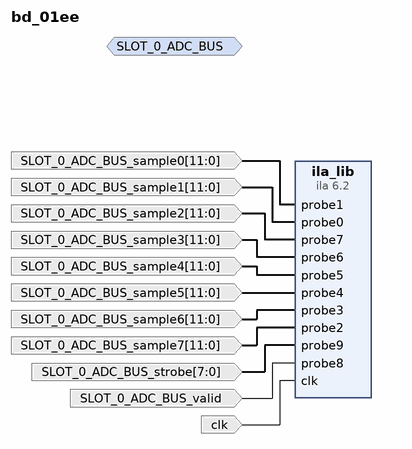
[diagram p0: block diagram of the top level]
# Vivado block design bd_01ee, xcku060-ffva1517-2-e, Vivado 2025.1
create_bd_design bd_01ee

create_bd_intf_port -mode Monitor -vlnv ti.com:user:adc_bus_rtl:1.0 SLOT_0_ADC_BUS
create_bd_port -dir I -type clk clk
create_bd_port -dir I -from 11 -to 0 SLOT_0_ADC_BUS_sample1
create_bd_port -dir I -from 11 -to 0 SLOT_0_ADC_BUS_sample0
create_bd_port -dir I -from 11 -to 0 SLOT_0_ADC_BUS_sample7
create_bd_port -dir I -from 11 -to 0 SLOT_0_ADC_BUS_sample6
create_bd_port -dir I -from 11 -to 0 SLOT_0_ADC_BUS_sample5
create_bd_port -dir I -from 11 -to 0 SLOT_0_ADC_BUS_sample4
create_bd_port -dir I -from 11 -to 0 SLOT_0_ADC_BUS_sample3
create_bd_port -dir I -from 11 -to 0 SLOT_0_ADC_BUS_sample2
create_bd_port -dir I SLOT_0_ADC_BUS_valid
create_bd_port -dir I -from 7 -to 0 SLOT_0_ADC_BUS_strobe

create_bd_cell -type ip -vlnv xilinx.com:ip:ila:6.2 ila_lib
set_property -dict [list \
  CONFIG.ALL_PROBE_SAME_MU TRUE \
  CONFIG.ALL_PROBE_SAME_MU_CNT 1 \
  CONFIG.C_ADV_TRIGGER FALSE \
  CONFIG.C_DATA_DEPTH 1024 \
  CONFIG.C_EN_STRG_QUAL 0 \
  CONFIG.C_ILA_CLK_FREQ 100000000 \
  CONFIG.C_INPUT_PIPE_STAGES 0 \
  CONFIG.C_MONITOR_TYPE Native \
  CONFIG.C_NUM_OF_PROBES 10 \
  CONFIG.C_PROBE0_TYPE 0 \
  CONFIG.C_PROBE0_WIDTH 12 \
  CONFIG.C_PROBE1_TYPE 0 \
  CONFIG.C_PROBE1_WIDTH 12 \
  CONFIG.C_PROBE2_TYPE 0 \
  CONFIG.C_PROBE2_WIDTH 12 \
  CONFIG.C_PROBE3_TYPE 0 \
  CONFIG.C_PROBE3_WIDTH 12 \
  CONFIG.C_PROBE4_TYPE 0 \
  CONFIG.C_PROBE4_WIDTH 12 \
  CONFIG.C_PROBE5_TYPE 0 \
  CONFIG.C_PROBE5_WIDTH 12 \
  CONFIG.C_PROBE6_TYPE 0 \
  CONFIG.C_PROBE6_WIDTH 12 \
  CONFIG.C_PROBE7_TYPE 0 \
  CONFIG.C_PROBE7_WIDTH 12 \
  CONFIG.C_PROBE8_TYPE 0 \
  CONFIG.C_PROBE8_WIDTH 1 \
  CONFIG.C_PROBE9_TYPE 0 \
  CONFIG.C_PROBE9_WIDTH 8 \
  CONFIG.C_TRIGIN_EN false \
  CONFIG.C_TRIGOUT_EN false \
  CONFIG.C_XLNX_HW_PROBE_INFO DEFAULT \
] [get_bd_cells ila_lib]

# ---- connections ----

connect_bd_net -net SLOT_0_ADC_BUS_sample0_1 [get_bd_ports SLOT_0_ADC_BUS_sample0] [get_bd_pins ila_lib/probe1]
connect_bd_net -net SLOT_0_ADC_BUS_sample1_1 [get_bd_ports SLOT_0_ADC_BUS_sample1] [get_bd_pins ila_lib/probe0]
connect_bd_net -net SLOT_0_ADC_BUS_sample2_1 [get_bd_ports SLOT_0_ADC_BUS_sample2] [get_bd_pins ila_lib/probe7]
connect_bd_net -net SLOT_0_ADC_BUS_sample3_1 [get_bd_ports SLOT_0_ADC_BUS_sample3] [get_bd_pins ila_lib/probe6]
connect_bd_net -net SLOT_0_ADC_BUS_sample4_1 [get_bd_ports SLOT_0_ADC_BUS_sample4] [get_bd_pins ila_lib/probe5]
connect_bd_net -net SLOT_0_ADC_BUS_sample5_1 [get_bd_ports SLOT_0_ADC_BUS_sample5] [get_bd_pins ila_lib/probe4]
connect_bd_net -net SLOT_0_ADC_BUS_sample6_1 [get_bd_ports SLOT_0_ADC_BUS_sample6] [get_bd_pins ila_lib/probe3]
connect_bd_net -net SLOT_0_ADC_BUS_sample7_1 [get_bd_ports SLOT_0_ADC_BUS_sample7] [get_bd_pins ila_lib/probe2]
connect_bd_net [get_bd_ports SLOT_0_ADC_BUS_strobe] [get_bd_pins ila_lib/probe9]
connect_bd_net [get_bd_ports SLOT_0_ADC_BUS_valid] [get_bd_pins ila_lib/probe8]
connect_bd_net [get_bd_ports clk] [get_bd_pins ila_lib/clk]

validate_bd_design
save_bd_design
